# Altium schematic sheet LazeRX-9c.SchDoc
size 279 x 203 mm
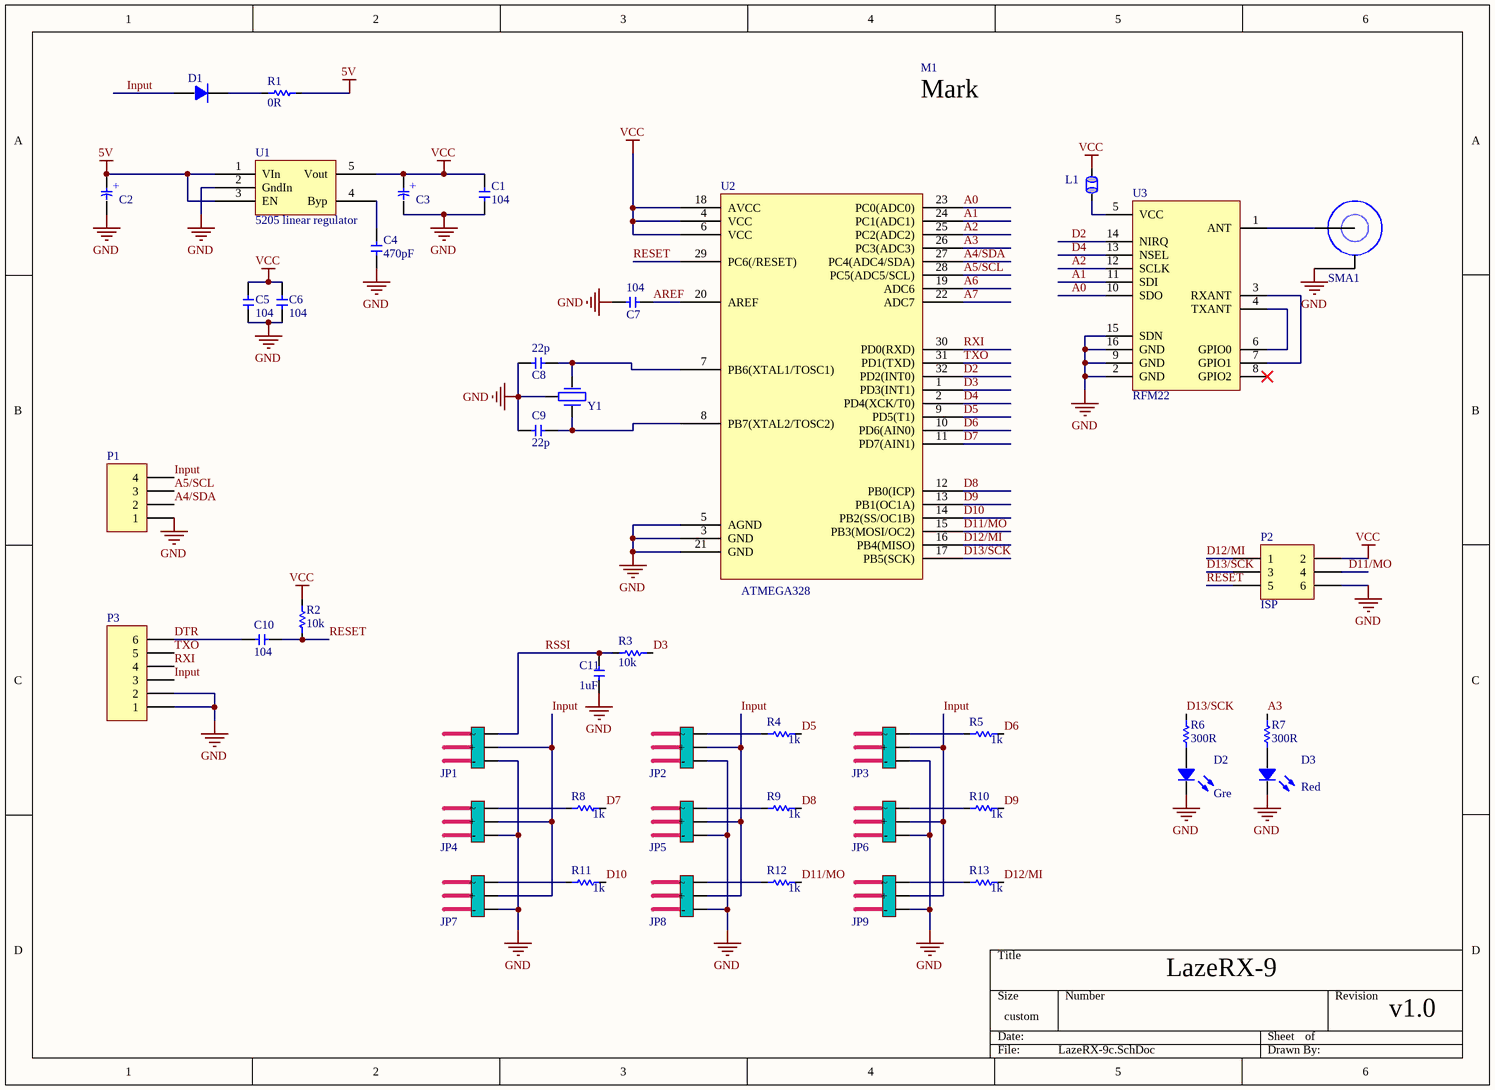
[diagram p0: LazeRX-9c.SchDoc]

## Parts
C1  104  [0603 CAP]
C2  4.7uF/6.3V  [1206]  (value not drawn)
C3  4.7uF/6.3V  [1206 CAP]  (value not drawn)
C4  470pF  [0603 CAP]
C5  104  [0603 CAP]
C6  104  [0603 CAP]
C7  104  [0603 CAP]
C8  22p  [0603 CAP]
C9  22p  [0603 CAP]
C10  104  [0603 CAP]
C11  1uF  [0603 CAP]
D1  Diode  [DIODE-SOD123]  (value not drawn)
D2  Gre  [0805 LED]
D3  Red  [0805 LED]
JP1  Servo out 1  [JP - compact]  (value not drawn)
JP2  Servo out 1  [JP - compact]  (value not drawn)
JP3  Servo out 1  [JP - compact]  (value not drawn)
JP4  Servo out 1  [JP - compact]  (value not drawn)
JP5  Servo out 1  [JP - compact]  (value not drawn)
JP6  Servo out 1  [JP - compact]  (value not drawn)
JP7  Servo out 1  [JP - compact]  (value not drawn)
JP8  Servo out 1  [JP - compact]  (value not drawn)
JP9  Servo out 1  [JP - compact]  (value not drawn)
L1  FB 300mA  [0603 IND]  (value not drawn)
M1  Mark  [MarkPoint]  (value not drawn)
P1  Header 4  [HDR1X4]  (value not drawn)
P2  ISP  [HDR2X3]
P3  Header 6  [HDR1X6]  (value not drawn)
R1  0R  [0603 RES]
R2  10k  [0603 RES]
R3  10k  [0603 RES]
R4  1k  [0603 RES]
R5  1k  [0603 RES]
R6  300R  [0603 RES]
R7  300R  [0603 RES]
R8  1k  [0603 RES]
R9  1k  [0603 RES]
R10  1k  [0603 RES]
R11  1k  [0603 RES]
R12  1k  [0603 RES]
R13  1k  [0603 RES]
SMA1  SMA Base  [ANT SMA]  (value not drawn)
U1  5205 linear regulator  [5205]
U2  ATmega328  [ATMEGA328FIX]  (value not drawn)
U3  RFM22  [RFM22SMD]
Y1  Crystal3Foot  [Crystal3Foot]  (value not drawn)

## Nets
5V: C2.1(A) R1.1 U1.1(VIn) U1.3(EN)
GND: C1.1 C2.2(B) C3.2(B) C4.1 C5.1 C6.1 C7.1 C8.1 C9.1 C11.1 D2.2(K) D3.2(K) JP1.3(-) JP2.3(-) JP3.3(-) JP4.3(-) JP5.3(-) JP6.3(-) JP7.3(-) JP8.3(-) JP9.3(-) P1.1 P2.6 P3.1 P3.2 SMA1.2(Gnd) U1.2(GndIn) U2.3(GND) U2.5(AGND) U2.21(GND) U3.2(GND) U3.9(GND) U3.15(SDN) U3.16(GND) Y1.2
VCC: C1.2 C3.1(A) C5.2 C6.2 L1.2 P2.2 R2.1 U1.5(Vout) U2.4(VCC) U2.6(VCC) U2.18(AVCC)
A0: U2.23(PC0(ADC0)) U3.10(SDO)
A1: U2.24(PC1(ADC1)) U3.11(SDI)
A2: U2.25(PC2(ADC2)) U3.12(SCLK)
A3: R7.2 U2.26(PC3(ADC3))
A4/SDA: P1.2 U2.27(PC4(ADC4/SDA))
A5/SCL: P1.3 U2.28(PC5(ADC5/SCL))
A6: U2.19(ADC6)
A7: U2.22(ADC7)
AREF: C7.2 U2.20(AREF)
D2: U2.32(PD2(INT0)) U3.14(NIRQ)
D3: R3.1 U2.1(PD3(INT1))
D4: U2.2(PD4(XCK/T0)) U3.13(NSEL)
D5: R4.1 U2.9(PD5(T1))
D6: R5.1 U2.10(PD6(AIN0))
D7: R8.1 U2.11(PD7(AIN1))
D8: R9.1 U2.12(PB0(ICP))
D9: R10.1 U2.13(PB1(OC1A))
D10: R11.1 U2.14(PB2(SS/OC1B))
D11/MO: P2.4 R12.1 U2.15(PB3(MOSI/OC2))
D12/MI: P2.1 R13.1 U2.16(PB4(MISO))
D13/SCK: P2.3 R6.2 U2.17(PB5(SCK))
DTR: C10.2 P3.6
Input: D1.1(A) JP1.2(+) JP2.2(+) JP3.2(+) JP4.2(+) JP5.2(+) JP6.2(+) JP7.2(+) JP8.2(+) JP9.2(+) P1.4 P3.3
RESET: C10.1 P2.5 R2.2 U2.29(PC6(/RESET))
RSSI: C11.2 JP1.1 R3.2
RXI: P3.4 U2.30(PD0(RXD))
TXO: P3.5 U2.31(PD1(TXD))
NetC4_2: C4.2 U1.4(Byp)
NetC8_2: C8.2 U2.7(PB6(XTAL1/TOSC1)) Y1.1
NetC9_2: C9.2 U2.8(PB7(XTAL2/TOSC2)) Y1.3
NetD1_2: D1.2(B) R1.2
NetD2_1: D2.1(A) R6.1
NetD3_1: D3.1(A) R7.1
NetJP2_1: JP2.1 R4.2
NetJP3_1: JP3.1 R5.2
NetJP4_1: JP4.1 R8.2
NetJP5_1: JP5.1 R9.2
NetJP6_1: JP6.1 R10.2
NetJP7_1: JP7.1 R11.2
NetJP8_1: JP8.1 R12.2
NetJP9_1: JP9.1 R13.2
NetL1_1: L1.1 U3.5(VCC)
NetSMA1_1: SMA1.1(Ant) U3.1(ANT)
NetU3_3: U3.3(RXANT) U3.7(GPIO1)
NetU3_4: U3.4(TXANT) U3.6(GPIO0)

Not connected (* = marked no-connect by the designer): U3 8(GPIO2)*

## Notes on the sheet
- LazeRX-9
- v1.0
- (in symbol ATmega328) ATMEGA328
- (in symbol Cap Pol) +

## Library data of the parts
C1 C4-C11 = CAP: Capacitor; Value: 100nF; Published: 8-Jun-2000; Revision: July-2002: Re-released for DXP Platform.; Publisher: Altium Limited
C2 C3 = Cap Pol: Capacitor
D2 D3 = LED: Typical RED, GREEN, YELLOW, AMBER GaAs LED; Published: 8-Jun-2000; LatestRevisionDate: 17-Jul-2002; LatestRevisionNote: Re-released for DXP Platform.; PackageDocument: Feb-2002; PackageReference: 3.2X1.6X1.1; Publisher: Altium Limited
JP1-JP9 = Hdr 3 Pin 0.1: Header, 3-Pin, 0.1"; Manufacturer: Generic Components; Class: Connector; Supplier 1: Digi-Key; Supplier Part Number 1: MTLW-103-23-S-S-260-ND
L1 = FerriteBead_300mA: Ferrite Bead 300mA; Manufacturer: Generic Components; Class: Passive; Supplier 1: Digi-Key; Supplier Part Number 1: 732-1586-1-ND
P1 = Header 4: Header, 4-Pin; LatestRevisionDate: 17-Jul-2002; LatestRevisionNote: Re-released for DXP Platform.; Publisher: Altium Limited
P2 = Header 3X2: Header, 3-Pin, Dual row; LatestRevisionDate: 17-Jul-2002; LatestRevisionNote: Re-released for DXP Platform.; Publisher: Altium Limited
P3 = Header 6: Header, 6-Pin; LatestRevisionDate: 17-Jul-2002; LatestRevisionNote: Re-released for DXP Platform.; Publisher: Altium Limited
R1-R13 = Res: Resistor; Published: 8-Jun-2000; Revision: July-2002: Re-released for DXP Platform.; Publisher: Altium Limited